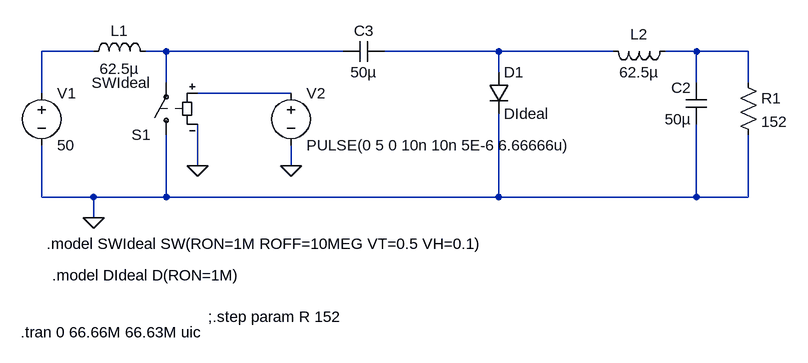
[diagram p0: schematic problem1.asc]
problem1.asc, the LTspice schematic file:
Version 4
SHEET 1 1188 680
WIRE 112 112 32 112
WIRE 224 112 192 112
WIRE 496 112 224 112
WIRE 736 112 560 112
WIRE 912 112 736 112
WIRE 1040 112 992 112
WIRE 1120 112 1040 112
WIRE 736 144 736 112
WIRE 224 160 224 112
WIRE 1040 160 1040 112
WIRE 1120 160 1120 112
WIRE 32 176 32 112
WIRE 416 176 272 176
WIRE 272 288 272 224
WIRE 416 288 416 256
WIRE 32 336 32 256
WIRE 112 336 32 336
WIRE 224 336 224 240
WIRE 224 336 112 336
WIRE 736 336 736 208
WIRE 736 336 224 336
WIRE 1040 336 1040 224
WIRE 1040 336 736 336
WIRE 1120 336 1120 240
WIRE 1120 336 1040 336
WIRE 112 368 112 336
FLAG 112 368 0
FLAG 272 288 0
FLAG 416 288 0
DATAFLAG 80 336 ""
SYMBOL voltage 32 160 R0
WINDOW 123 0 0 Left 0
WINDOW 39 0 0 Left 0
SYMATTR InstName V1
SYMATTR Value 50
SYMBOL ind 96 128 R270
WINDOW 0 32 56 VTop 2
WINDOW 3 5 56 VBottom 2
SYMATTR InstName L1
SYMATTR Value 62.5µ
SYMBOL ind 1008 96 R90
WINDOW 0 5 56 VBottom 2
WINDOW 3 32 56 VTop 2
SYMATTR InstName L2
SYMATTR Value 62.5µ
SYMBOL cap 1056 224 R180
WINDOW 0 24 56 Left 2
WINDOW 3 24 8 Left 2
SYMATTR InstName C2
SYMATTR Value 50µ
SYMBOL res 1104 144 R0
SYMATTR InstName R1
SYMATTR Value 152
SYMBOL diode 720 144 R0
SYMATTR InstName D1
SYMATTR Value DIdeal
SYMBOL sw 224 256 R180
SYMATTR InstName S1
SYMATTR Value SWIdeal
SYMBOL voltage 416 160 R0
WINDOW 123 0 0 Left 0
WINDOW 39 0 0 Left 0
SYMATTR InstName V2
SYMATTR Value PULSE(0 5 0 10n 10n 5E-6 6.66666u)
SYMBOL cap 560 96 R90
WINDOW 0 0 32 VBottom 2
WINDOW 3 32 32 VTop 2
SYMATTR InstName C3
SYMATTR Value 50µ
TEXT 288 520 Left 2 !;.step param R 152
TEXT 0 544 Left 2 !.tran 0 66.66M 66.63M uic
TEXT 40 408 Left 2 !.model SWIdeal SW(RON=1M ROFF=10MEG VT=0.5 VH=0.1)
TEXT 48 456 Left 2 !.model DIdeal D(RON=1M)

The netlist it stands for:
* problem1.asc
V1 N001 0 50
L1 N001 N002 62.5µ
L2 N004 N003 62.5µ
C2 0 N004 50µ
R1 N004 0 152
D1 N003 0 DIdeal
S1 0 N002 N005 0 SWIdeal
V2 N005 0 PULSE(0 5 0 10n 10n 5E-6 6.66666u)
C3 N003 N002 50µ
.model D D
.lib standard.dio
;.step param R 152
.tran 0 66.66M 66.63M uic
.model SWIdeal SW(RON=1M ROFF=10MEG VT=0.5 VH=0.1)
.model DIdeal D(RON=1M)
.backanno
.end